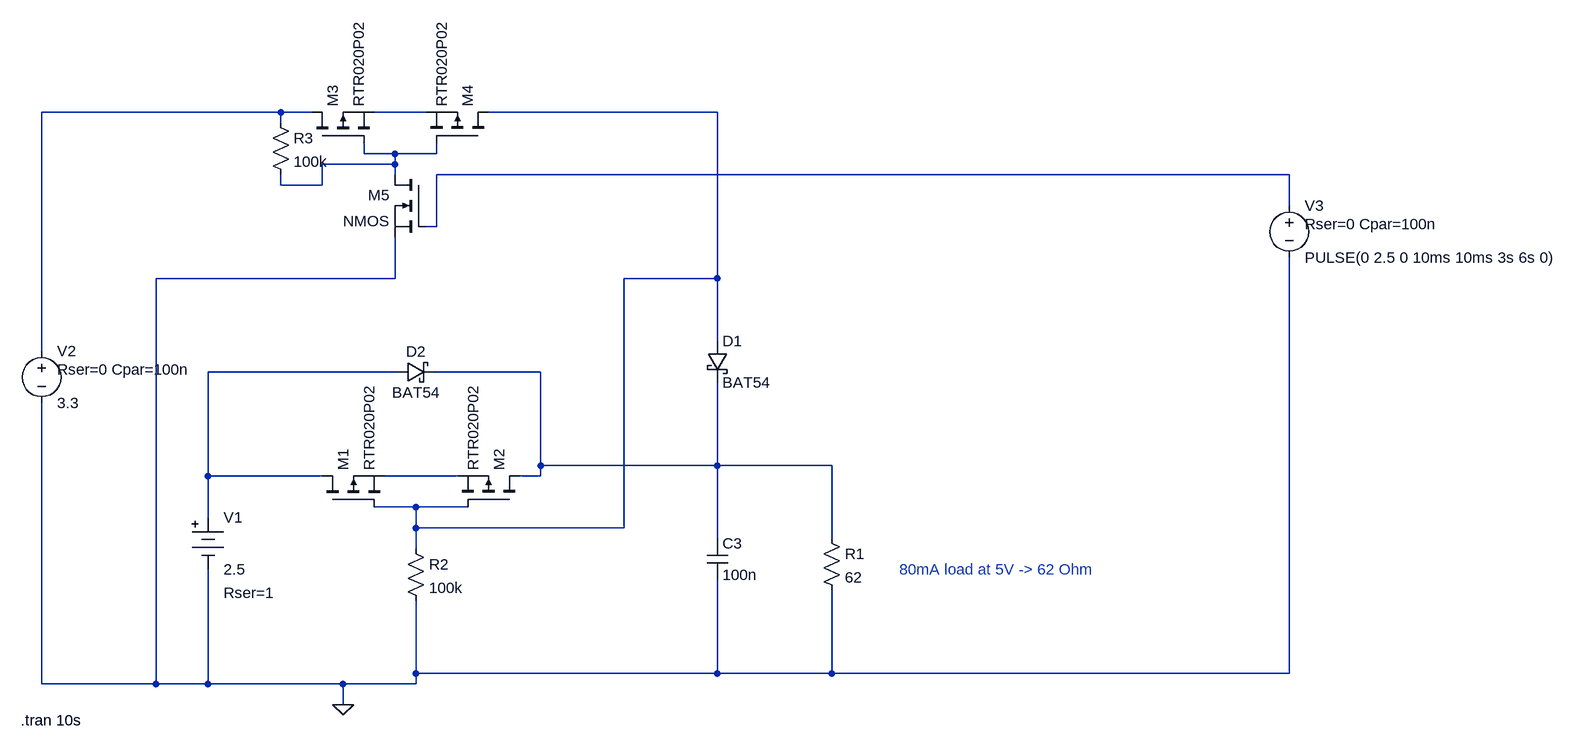
[diagram p0: schematic power switch.asc]
power switch.asc, the LTspice schematic file:
Version 4
SHEET 1 1808 680
WIRE -176 -480 -544 -480
WIRE -128 -480 -176 -480
WIRE 48 -480 -32 -480
WIRE 496 -480 144 -480
WIRE -176 -464 -176 -480
WIRE -48 -416 -48 -432
WIRE 0 -416 -48 -416
WIRE 64 -416 64 -432
WIRE 64 -416 0 -416
WIRE 0 -400 0 -416
WIRE 0 -400 -112 -400
WIRE 0 -384 0 -400
WIRE 1376 -384 64 -384
WIRE -176 -368 -176 -384
WIRE -112 -368 -112 -400
WIRE -112 -368 -176 -368
WIRE 1376 -336 1376 -384
WIRE 64 -304 64 -384
WIRE 64 -304 48 -304
WIRE 0 -224 0 -288
WIRE 0 -224 -368 -224
WIRE 496 -224 496 -480
WIRE 496 -224 352 -224
WIRE 496 -128 496 -224
WIRE -544 -112 -544 -480
WIRE 0 -80 -288 -80
WIRE 224 -80 64 -80
WIRE 224 64 224 -80
WIRE 496 64 496 -64
WIRE 496 64 224 64
WIRE 672 64 496 64
WIRE -288 80 -288 -80
WIRE -112 80 -288 80
WIRE 96 80 -16 80
WIRE 224 80 224 64
WIRE 224 80 192 80
WIRE 32 128 -32 128
WIRE 112 128 32 128
WIRE -288 144 -288 80
WIRE 32 160 32 128
WIRE 352 160 352 -224
WIRE 352 160 32 160
WIRE 496 176 496 64
WIRE 672 176 672 64
WIRE 32 192 32 160
WIRE 32 384 32 272
WIRE 496 384 496 240
WIRE 496 384 32 384
WIRE 672 384 672 256
WIRE 672 384 496 384
WIRE 1376 384 1376 -256
WIRE 1376 384 672 384
WIRE -544 400 -544 -32
WIRE -368 400 -368 -224
WIRE -368 400 -544 400
WIRE -288 400 -288 224
WIRE -288 400 -368 400
WIRE -80 400 -288 400
WIRE 32 400 32 384
WIRE 32 400 -80 400
WIRE -80 432 -80 400
FLAG -80 432 0
SYMBOL pmos -112 128 R270
SYMATTR InstName M1
SYMATTR Value RTR020P02
SYMBOL pmos 192 128 M270
SYMATTR InstName M2
SYMATTR Value RTR020P02
SYMBOL Misc\\battery -288 128 R0
WINDOW 123 0 0 Left 0
WINDOW 39 24 132 Left 2
SYMATTR SpiceLine Rser=1
SYMATTR InstName V1
SYMATTR Value 2.5
SYMBOL voltage -544 -128 R0
WINDOW 123 0 0 Left 0
WINDOW 39 24 44 Left 2
SYMATTR SpiceLine Rser=0 Cpar=100n
SYMATTR InstName V2
SYMATTR Value 3.3
SYMBOL res 656 160 R0
SYMATTR InstName R1
SYMATTR Value 62
SYMBOL schottky 480 -128 R0
SYMATTR InstName D1
SYMATTR Value BAT54
SYMATTR Description Diode
SYMATTR Type diode
SYMBOL res 16 176 R0
SYMATTR InstName R2
SYMATTR Value 100k
SYMBOL schottky 0 -64 R270
WINDOW 0 32 32 VTop 2
WINDOW 3 0 32 VBottom 2
SYMATTR InstName D2
SYMATTR Value BAT54
SYMATTR Description Diode
SYMATTR Type diode
SYMBOL cap 480 176 R0
SYMATTR InstName C3
SYMATTR Value 100n
SYMBOL pmos -128 -432 R270
SYMATTR InstName M3
SYMATTR Value RTR020P02
SYMBOL pmos 144 -432 M270
SYMATTR InstName M4
SYMATTR Value RTR020P02
SYMBOL voltage 1376 -352 R0
WINDOW 123 0 0 Left 0
WINDOW 39 24 44 Left 2
SYMATTR SpiceLine Rser=0 Cpar=100n
SYMATTR InstName V3
SYMATTR Value PULSE(0 2.5 0 10ms 10ms 3s 6s 0)
SYMBOL nmos 48 -384 M0
SYMATTR InstName M5
SYMBOL res -192 -480 R0
SYMATTR InstName R3
SYMATTR Value 100k
TEXT -576 456 Left 2 !.tran 10s
TEXT 776 224 Left 2 ;80mA load at 5V -> 62 Ohm

The netlist it stands for:
* power switch.asc
M1 N006 N003 N008 N008 RTR020P02
M2 N007 N003 N008 N008 RTR020P02
V1 N006 0 2.5 Rser=1
V2 N001 0 3.3 Rser=0 Cpar=100n
R1 N007 0 62
D1 N003 N007 BAT54
R2 N003 0 100k
D2 N006 N007 BAT54
C3 N007 0 100n
M3 N001 N004 N002 N002 RTR020P02
M4 N003 N004 N002 N002 RTR020P02
V3 N005 0 PULSE(0 2.5 0 10ms 10ms 3s 6s 0) Rser=0 Cpar=100n
M5 N004 N005 0 0 NMOS
R3 N001 N004 100k
.model D D
.lib standard.dio
.model NMOS NMOS
.model PMOS PMOS
.lib standard.mos
.tran 10s
* 80mA load at 5V -> 62 Ohm
.backanno
.end